# Altium schematic sheet card_design.SchDoc
size A; SheetNumber: 1; SheetTotal: 2
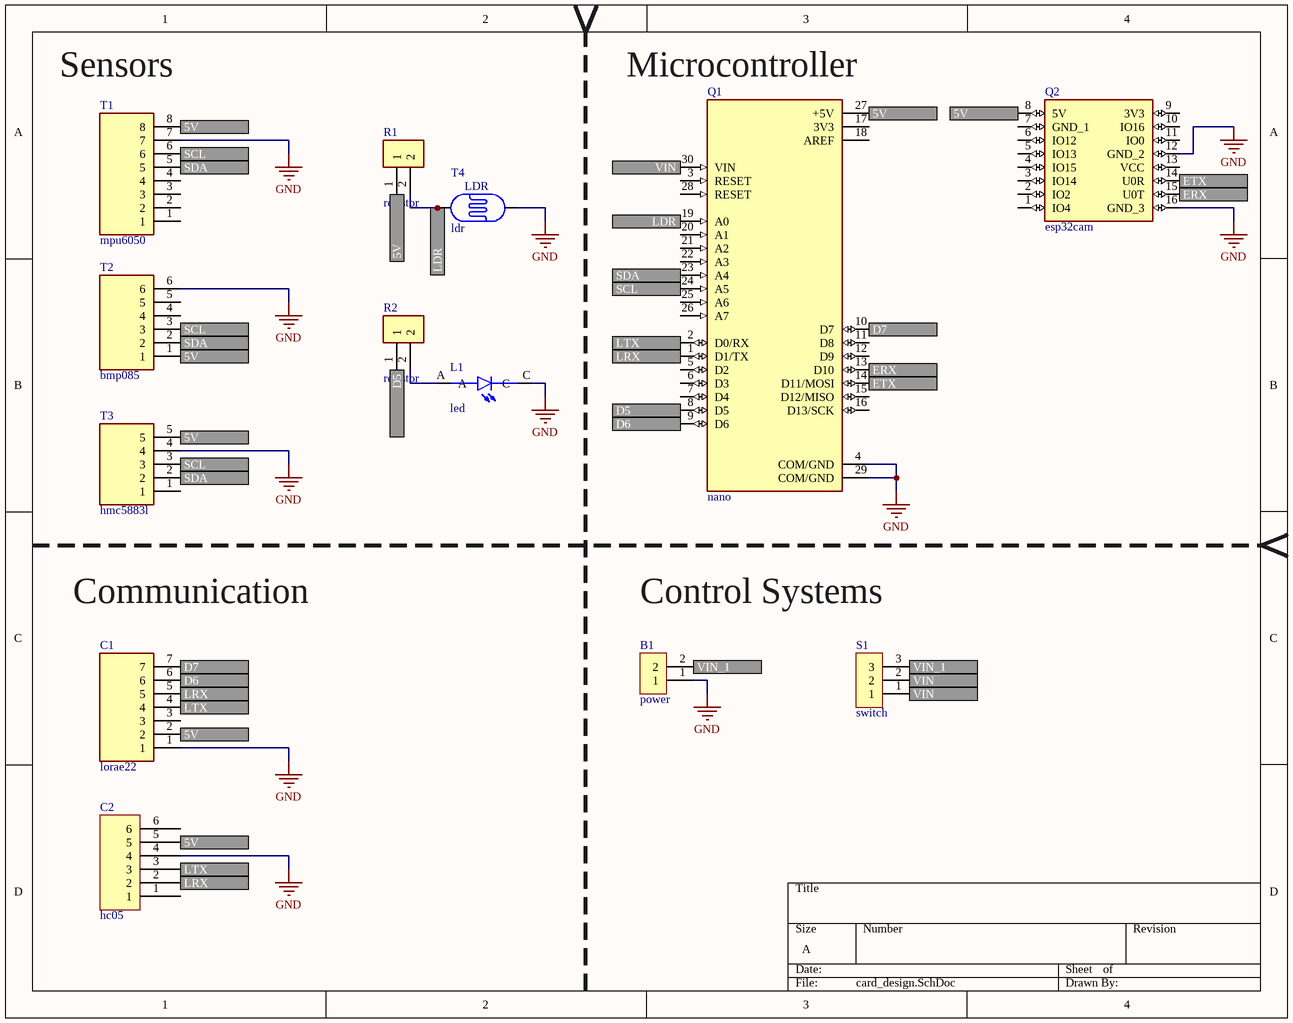
[diagram p0: card_design.SchDoc]

## Parts
B1  power  [power]
C1  lorae22  [lorae22]
C2  hc05  [hc05]
L1  led  [led]
Q1  nano  [nano]
Q2  esp32cam  [esp32cam]
R1  resistor  [resistor]
R2  resistor  [resistor]
S1  switch  [switch]
T1  mpu6050  [mpu6050]
T2  bmp085  [bmp085]
T3  hmc5883l  [hmc5883l]
T4  ldr  [ldr]

## Ports
5V (see card_design[1A], card_design[1B], card_design[1C], card_design[1D], card_design[2B], card_design[3A]), 5V (see card_design[1A], card_design[1B], card_design[1C], card_design[1D], card_design[3A]), 5V (see card_design[1A], card_design[1B], card_design[1C], card_design[2B], card_design[3A]), 5V (see card_design[1A], card_design[1B], card_design[1D], card_design[2B], card_design[3A]), 5V (see card_design[1B], card_design[1C], card_design[1D], card_design[2B], card_design[3A]), D5 (see card_design[2B]), D6 (see card_design[1C]), D6 (see card_design[2B]), D7 (see card_design[1C]), D7 (see card_design[3B]), ERX (see card_design[3B]), ERX (see card_design[4A]), ETX (see card_design[3B]), ETX (see card_design[4A]), LDR (see card_design[2A]), LDR (see card_design[2B]), LRX (see card_design[1C], card_design[1D]), LRX (see card_design[1C], card_design[2B]), LRX (see card_design[1D], card_design[2B]), LTX (see card_design[1C], card_design[1D]), LTX (see card_design[1C], card_design[2B]), LTX (see card_design[1D], card_design[2B]), SCL (see card_design[1A], card_design[1B]), SCL (see card_design[1A], card_design[1B], card_design[2B]), SCL (see card_design[1B], card_design[2B]), SDA (see card_design[1A], card_design[1B]), SDA (see card_design[1A], card_design[1B], card_design[2B]), SDA (see card_design[1B], card_design[2B]), VIN (see card_design[2A], card_design[3C]), VIN (see card_design[3C]), VIN_1 (see card_design[3C])

## Nets
GND: B1.1 C1.1 C2.4 L1.C Q1.4(COM/GND) Q1.29(COM/GND) Q2.12(GND_2) Q2.16(GND_3) T1.7 T2.6 T3.4 T4.2(P$2)
5V: C1.2 C2.5 Q1.27(+5V) Q2.8(5V) R1.1 T1.8 T2.1 T3.5 ; port 5V
D5: Q1.8(D5) R2.1 ; port D5
D6: C1.6 Q1.9(D6) ; port D6
D7: C1.7 Q1.10(D7) ; port D7
ERX: Q1.13(D10) Q2.15(U0T) ; port ERX
ETX: Q1.14(D11/MOSI) Q2.14(U0R) ; port ETX
LDR: Q1.19(A0) R1.2 T4.1(P$1) ; port LDR
LRX: C1.5 C2.2 Q1.1(D1/TX) ; port LRX
LTX: C1.4 C2.3 Q1.2(D0/RX) ; port LTX
SCL: Q1.24(A5) T1.6 T2.3 T3.3 ; port SCL
SDA: Q1.23(A4) T1.5 T2.2 T3.2 ; port SDA
VIN: Q1.30(VIN) S1.1 S1.2 ; port VIN
VIN_1: B1.2 S1.3 ; port VIN_1
NetL1_A: L1.A R2.2

Not connected (* = marked no-connect by the designer): C1 3; C2 1 6; Q1 3(RESET) 5(D2) 6(D3) 7(D4) 11(D8) 12(D9) 15(D12/MISO) 16(D13/SCK) 17(3V3) 18(AREF) 20(A1) 21(A2) 22(A3) 25(A6) 26(A7) 28(RESET); Q2 1(IO4) 2(IO2) 3(IO14) 4(IO15) 5(IO13) 6(IO12) 7(GND_1) 9(3V3) 10(IO16) 11(IO0) 13(VCC); T1 1 2 3 4; T2 4 5; T3 1

## Notes on the sheet
- (near T1) Sensors
- (near Q1) Microcontroller
- Communication
- Control Systems
- (in symbol ldr) LDR